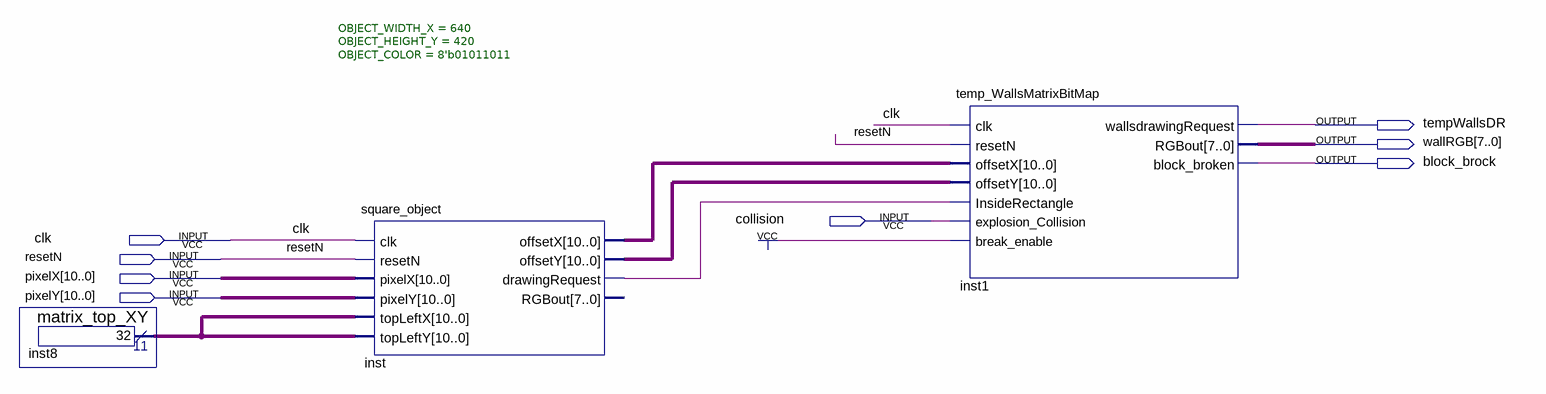
[diagram p0: schematic sheet]
// Quartus schematic temp_walls.bdf as structural Verilog: 3 symbols, 8 pins
module temp_walls (
  input  collision,
  input  clk,
  input  resetN,
  input  [10:0] pixelX,
  input  [10:0] pixelY,
  output tempWallsDR,
  output [7:0] wallRGB,
  output block_brock
);

  wire inst_drawingrequest;
  wire [10:0] inst8_result, inst_offsetx, inst_offsety;

  matrix_top_XY inst8 (.result(inst8_result));
  square_object #(.OBJECT_WIDTH_X(640), .OBJECT_HEIGHT_Y(420), .OBJECT_COLOR(8'b01011011)) inst (
    .clk(clk), .resetN(resetN), .pixelX(pixelX), .pixelY(pixelY), .topLeftX(inst8_result),
    .topLeftY(inst8_result), .offsetX(inst_offsetx), .offsetY(inst_offsety),
    .drawingRequest(inst_drawingrequest));  // open: RGBout
  temp_WallsMatrixBitMap inst1 (
    .clk(clk), .resetN(resetN), .offsetX(inst_offsetx), .offsetY(inst_offsety),
    .InsideRectangle(inst_drawingrequest), .explosion_Collision(collision), .break_enable(1'b1),
    .wallsdrawingRequest(tempWallsDR), .RGBout(wallRGB), .block_broken(block_brock));
endmodule
